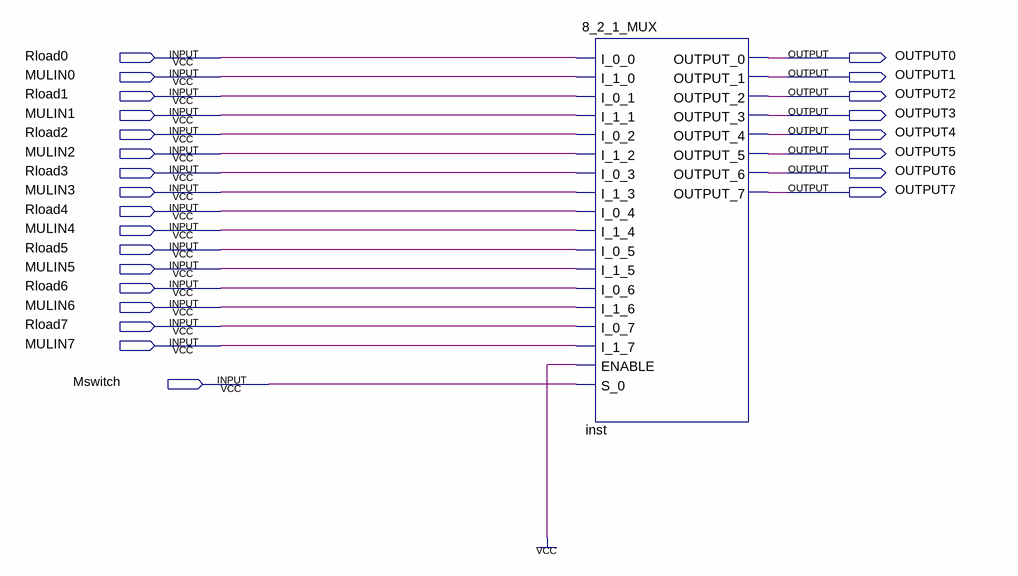
[diagram p0: schematic sheet]
// Quartus schematic ROR1INPUT.bdf as structural Verilog: 1 symbols, 25 pins
module ROR1INPUT (
  input  Rload0,
  input  MULIN0,
  input  Rload1,
  input  MULIN1,
  input  Rload2,
  input  MULIN2,
  input  Rload3,
  input  MULIN3,
  input  Rload4,
  input  MULIN4,
  input  Rload5,
  input  MULIN5,
  input  Rload6,
  input  MULIN6,
  input  Rload7,
  input  MULIN7,
  input  Mswitch,
  output OUTPUT0,
  output OUTPUT1,
  output OUTPUT2,
  output OUTPUT3,
  output OUTPUT4,
  output OUTPUT5,
  output OUTPUT6,
  output OUTPUT7
);

  \8_2_1_MUX  inst (
    .I_0_0(Rload0), .I_1_0(MULIN0), .I_0_1(Rload1), .I_1_1(MULIN1), .I_0_2(Rload2), .I_1_2(MULIN2),
    .I_0_3(Rload3), .I_1_3(MULIN3), .I_0_4(Rload4), .I_1_4(MULIN4), .I_0_5(Rload5), .I_1_5(MULIN5),
    .I_0_6(Rload6), .I_1_6(MULIN6), .I_0_7(Rload7), .I_1_7(MULIN7), .ENABLE(1'b1), .S_0(Mswitch),
    .OUTPUT_0(OUTPUT0), .OUTPUT_1(OUTPUT1), .OUTPUT_2(OUTPUT2), .OUTPUT_3(OUTPUT3), .OUTPUT_4(OUTPUT4),
    .OUTPUT_5(OUTPUT5), .OUTPUT_6(OUTPUT6), .OUTPUT_7(OUTPUT7));
endmodule
